# EAGLE design untitled (EAGLE 7.7.0)
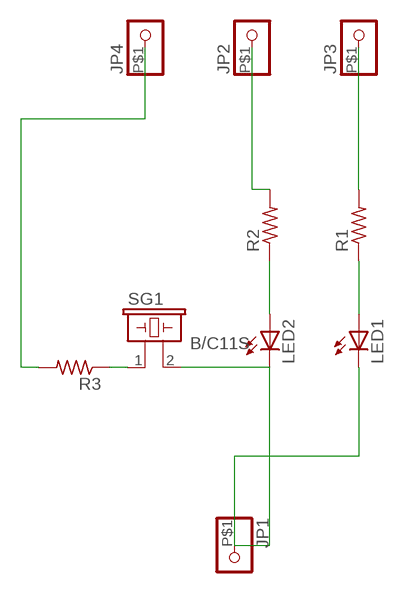
[diagram p0: schematic, sheet 1]

## Parts
JP1  PINHD-1X1-BIGPOGO  [1X1-BIGPOGO]
JP2  PINHD-1X1-BIGPOGO  [1X1-BIGPOGO]
JP3  PINHD-1X1-BIGPOGO  [1X1-BIGPOGO]
JP4  PINHD-1X1-BIGPOGO  [1X1-BIGPOGO]
LED1  LEDB152  [Q62902-B152]
LED2  LEDB152  [Q62902-B152]
R1  FLIPFLOP-RES  [0805-THM]
R2  FLIPFLOP-RES  [0805-THM]
R3  FLIPFLOP-RES  [0805-THM]
SG1  B/C11S  [B/C11S]

## Nets
N$1: JP1.P$1 LED1.K(C) LED2.K(C) SG1.2
N$2: JP3.P$1 R1.2
N$3: LED1.A R1.1
N$4: LED2.A R2.1
N$5: JP2.P$1 R2.2
N$6: R3.1 SG1.1
N$7: JP4.P$1 R3.2

## Library data of the parts
JP1-JP4 = adafruit:PINHD-1X1: Pin header 1x1 for 0.1" spacing With round pins
LED1 LED2 = adafruit:LED: LED OSRAM: - CHIPLED LG R971, LG N971, LY N971, LG Q971, LY Q971, LO R971, LY R971 LH N974, LH R974 LS Q976, LO Q976, LY Q976 LO Q996 - Hyper CHIPLED LW Q18S LB Q993, LB Q99A, LB R99A - SideLED LS A670, LO A670, LY A670, LG A670, LP A670 LB A673, LV A673, LT A673, LW A673 LH A674 LY A675 LS A676, LA A676, LO A676, LY A676, LW A676 LS A679, LY A679, LG A679 - Hyper Micro SIDELED® LS Y876, LA Y876, LO Y876, LY Y876 LT Y87S - SmartLED LW L88C, LW L88S LB L89C, LB L89S, LG L890 LS L89K, LO L89K, LY L89K LS L896, LA L896, LO L896, LY L896 - TOPLED LS T670, LO T670, LY T670, LG T670, LP T670 LSG T670, LSP T670, LSY T670, LOP T670, LYG T670 LG T671, LOG T671, LSG T671 LB T673, LV T673, LT T673, LW T673 LH T674 LS T676, LA T676, LO T676, LY T676, LB T676, LH T676, LSB T676, LW T676 LB T67C, LV T67C, LT T67C, LS T67K, LO T67K, LY T67K, LW E67C LS E67B, LA E67B, LO E67B, LY E67B, LB E67C, LV E67C, LT E67C LW T67C LS T679, LY T679, LG T679 LS T770, LO T770, LY T770, LG T770, LP T770 LB T773, LV T773, LT T773, LW T773 LH T774 LS E675, LA E675, LY E675, LS T675 LS T776, LA T776, LO T776, LY T776, LB T776 LHGB T686 LT T68C, LB T68C - Hyper Mini TOPLED® LB M676 - Mini TOPLED Santana® LG M470 LS M47K, LO M47K, LY M47K Source: http://www.osram.convergy.de/
R1-R3 = adafruit:FLIPFLOP-RES: Flip Flop resistor An 0805 resistor inside a standard 1/4W 5% resistor. Makes for easy mods
SG1 = buzzer:B/C11S: BUZZER Source: Buerklin; OC_FARNELL: unknown; OC_NEWARK: unknown

## Board
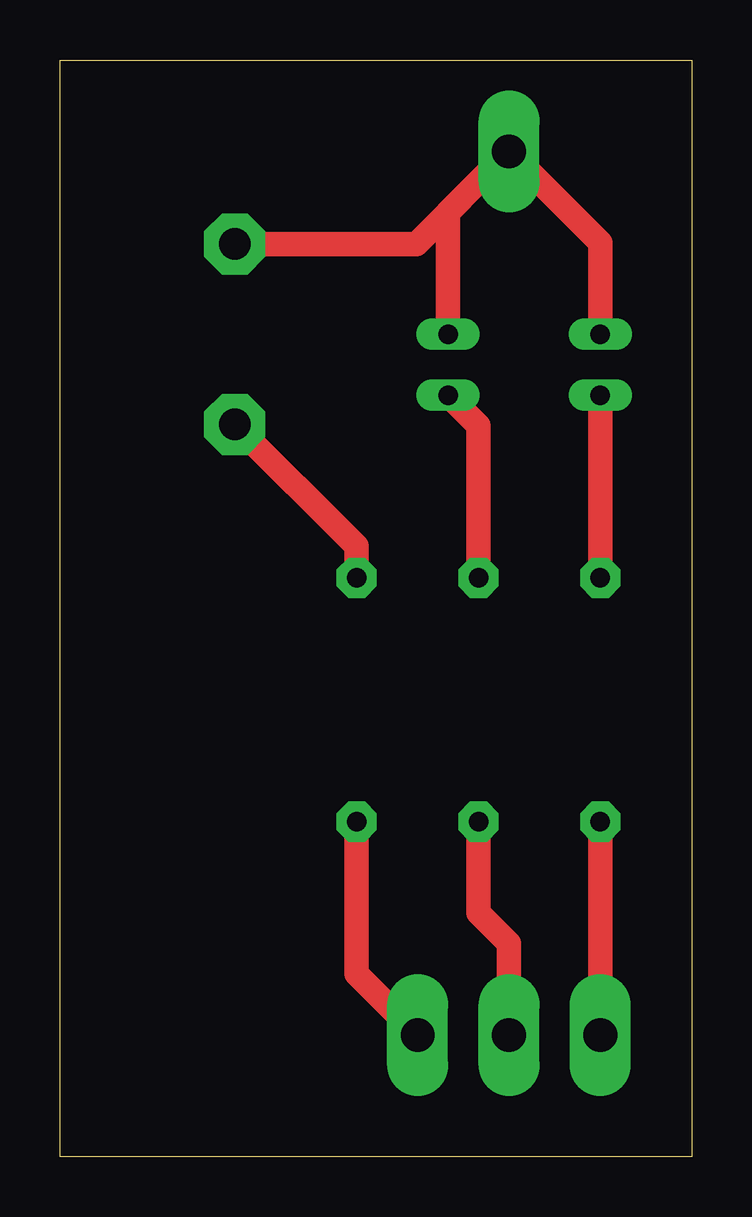
[diagram p1: board, top side]
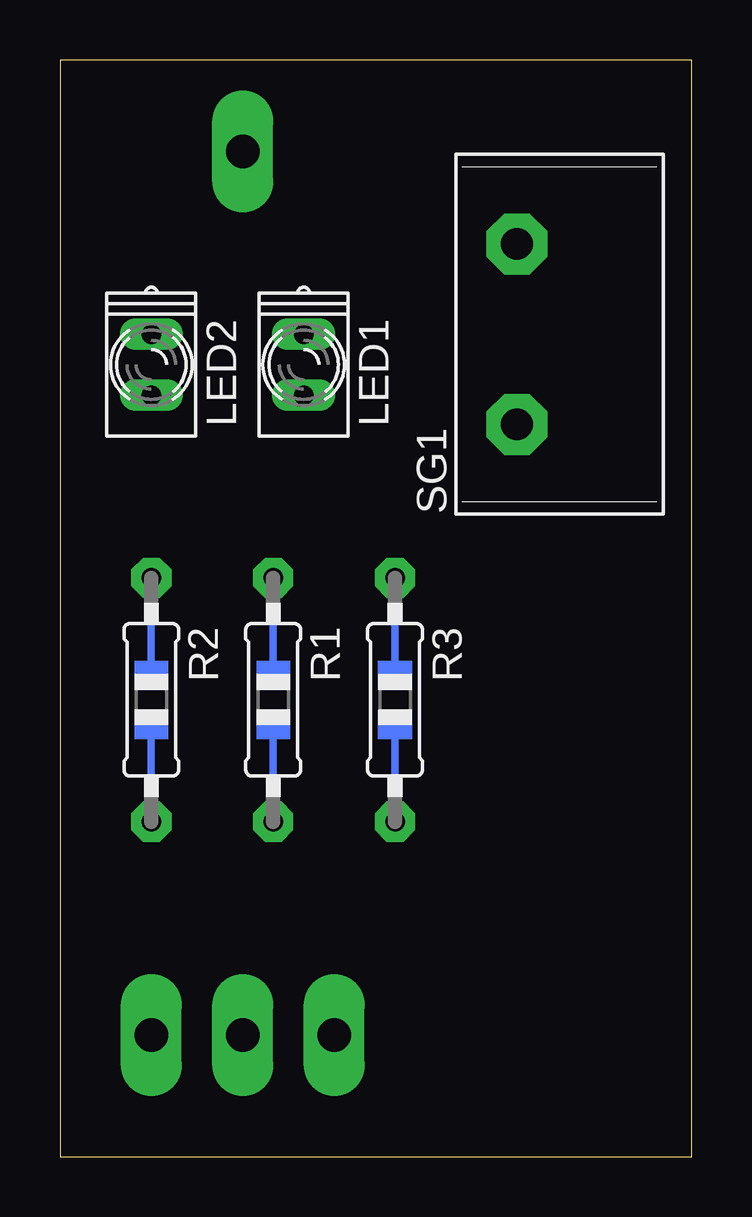
[diagram p2: board, bottom side, seen from below]

Size 26.34 x 45.71 mm. Coordinates in mm from the lower left corner, seen from the top.
Outline: 26.34,0 0,0 0,45.71 26.34,45.71 26.34,0
Copper layers (1*16): Top 0.035mm / dielectric 1.5mm / Bottom 0.035mm
Design rules "default": minimum track width 10mil, minimum drill 24mil, track to track 8mil, track to pad 8mil, pad to pad 8mil, via to via 8mil, smd to smd 8mil, copper to edge 40mil, drill to drill 8mil, minimum pad ring 10mil, minimum via ring 8mil, stop-mask expansion 4mil, vias tented up to drill 0mil, thermal gap 10mil

### Footprints (pad centres in the part's own frame; a part is rotated, then mirrored left to right if it is on the bottom)
1X1-BIGPOGO = drill 1.4 pad 2.54 long: P$1 0,0
Q62902-B152 = drill 0.813 long: A 1.27,0; K -1.27,0
0805-THM = drill 0.813 pad 1.676 octagon: 1 -5.08,0; 2 5.08,0
B/C11S = drill 1.321 pad 2.54 octagon: 1 -3.759,0; 2 3.759,0

### Placement (x,y rotation side)
JP1  18.72,41.91 90 bottom
JP2  22.53,5.08 90 bottom
JP3  18.72,5.08 90 bottom
JP4  14.91,5.08 90 bottom
LED1  16.18,33.02 270 bottom
LED2  22.53,33.02 270 bottom
R1  17.45,19.05 270 bottom
R2  22.53,19.05 270 bottom
R3  12.37,19.05 270 bottom
SG1  7.29,34.29 90 bottom

### Tracks (layer width: path | path; a pad name or v marks a point on that pad's centre or on a via)
N$1
  Top 1.016: SG1.2 14.86,38.05 JP1.P$1 | LED1.K 16.18,39.37 JP1.P$1 | LED2.K 22.53,38.1 JP1.P$1
N$2
  Top 1.016: R1.2 17.45,10.16 18.72,8.89 JP3.P$1
N$3
  Top 1.016: R1.1 17.45,30.48 LED1.A
N$4
  Top 1.016: R2.1 LED2.A
N$5
  Top 1.016: R2.2 JP2.P$1
N$6
  Top 1.016: R3.1 12.37,25.45 SG1.1
N$7
  Top 1.016: R3.2 12.37,7.62 JP4.P$1